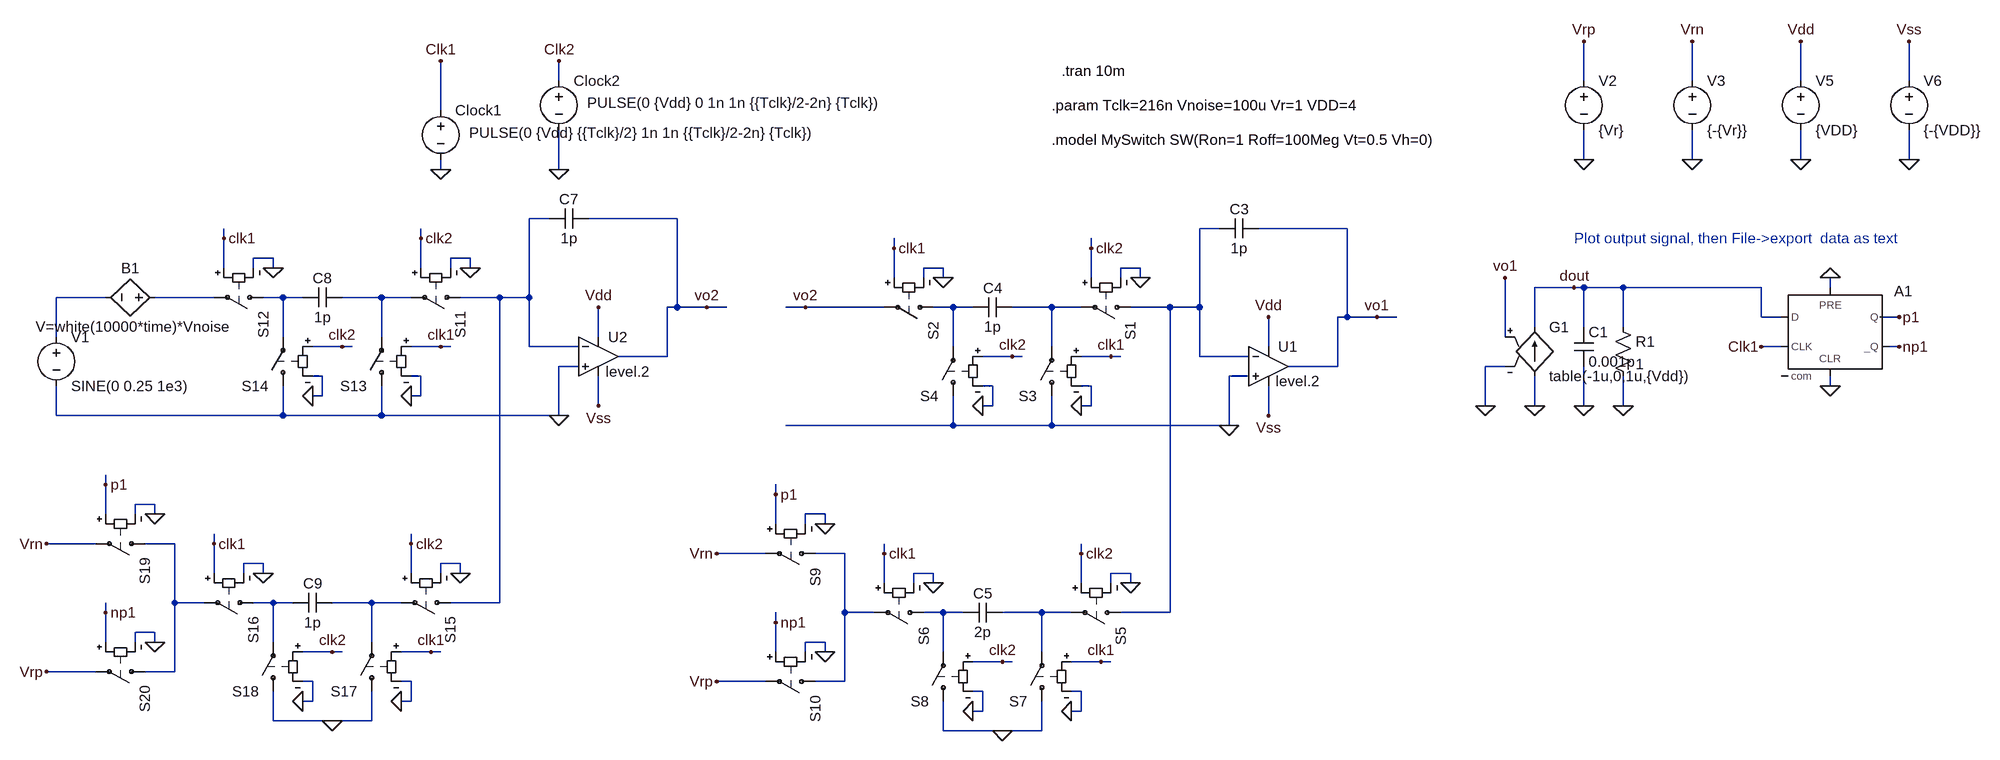
[diagram p0: schematic SC_second_order_v1.asc]
SC_second_order_v1.asc, the LTspice schematic file:
Version 4.1
SHEET 1 948 804
WIRE -1440 -880 -1440 -912
WIRE 224 -880 224 -944
WIRE 400 -880 400 -944
WIRE 576 -880 576 -944
WIRE 752 -880 752 -944
WIRE -1632 -832 -1632 -912
WIRE 224 -752 224 -800
WIRE 400 -752 400 -800
WIRE 576 -752 576 -800
WIRE 752 -752 752 -800
WIRE -1632 -736 -1632 -752
WIRE -1440 -736 -1440 -800
WIRE -1456 -656 -1488 -656
WIRE -1248 -656 -1392 -656
WIRE -368 -640 -400 -640
WIRE -160 -640 -304 -640
WIRE -1984 -624 -1984 -640
WIRE -1664 -624 -1664 -640
WIRE -896 -608 -896 -624
WIRE -576 -608 -576 -624
WIRE -1904 -592 -1936 -592
WIRE -1584 -592 -1616 -592
WIRE -1984 -576 -1984 -624
WIRE -1936 -576 -1936 -592
WIRE -1904 -576 -1904 -592
WIRE -1664 -576 -1664 -624
WIRE -1616 -576 -1616 -592
WIRE -1584 -576 -1584 -592
WIRE -816 -576 -848 -576
WIRE -496 -576 -528 -576
WIRE -896 -560 -896 -608
WIRE -848 -560 -848 -576
WIRE -816 -560 -816 -576
WIRE -576 -560 -576 -608
WIRE -528 -560 -528 -576
WIRE -496 -560 -496 -576
WIRE 208 -544 144 -544
WIRE 224 -544 208 -544
WIRE 288 -544 224 -544
WIRE 512 -544 288 -544
WIRE 624 -544 624 -560
WIRE -2176 -528 -2256 -528
WIRE -2000 -528 -2096 -528
WIRE -1888 -528 -1920 -528
WIRE -1856 -528 -1888 -528
WIRE -1728 -528 -1792 -528
WIRE -1680 -528 -1728 -528
WIRE -1536 -528 -1600 -528
WIRE -1488 -528 -1488 -656
WIRE -1488 -528 -1536 -528
WIRE -1248 -512 -1248 -656
WIRE -1248 -512 -1264 -512
WIRE -1200 -512 -1248 -512
WIRE -1168 -512 -1200 -512
WIRE -1040 -512 -1072 -512
WIRE -912 -512 -1040 -512
WIRE -800 -512 -832 -512
WIRE -768 -512 -800 -512
WIRE -640 -512 -704 -512
WIRE -592 -512 -640 -512
WIRE -448 -512 -512 -512
WIRE -400 -512 -400 -640
WIRE -400 -512 -448 -512
WIRE -160 -496 -160 -640
WIRE -160 -496 -176 -496
WIRE -112 -496 -160 -496
WIRE -80 -496 -112 -496
WIRE 512 -496 512 -544
WIRE 544 -496 512 -496
WIRE 736 -496 704 -496
WIRE 144 -480 144 -544
WIRE 224 -480 224 -544
WIRE 288 -480 288 -544
WIRE -2256 -464 -2256 -528
WIRE -1888 -464 -1888 -528
WIRE -1728 -464 -1728 -528
WIRE -1376 -464 -1376 -512
WIRE 96 -464 96 -560
WIRE -1792 -448 -1840 -448
WIRE -1776 -448 -1792 -448
WIRE -1632 -448 -1680 -448
WIRE -1616 -448 -1632 -448
WIRE -1488 -448 -1488 -528
WIRE -1408 -448 -1488 -448
WIRE -800 -448 -800 -512
WIRE -640 -448 -640 -512
WIRE -288 -448 -288 -496
WIRE 544 -448 512 -448
WIRE 736 -448 720 -448
WIRE -1264 -432 -1264 -512
WIRE -1264 -432 -1344 -432
WIRE -704 -432 -752 -432
WIRE -688 -432 -704 -432
WIRE -544 -432 -592 -432
WIRE -528 -432 -544 -432
WIRE -400 -432 -400 -512
WIRE -320 -432 -400 -432
WIRE -1408 -416 -1440 -416
WIRE -176 -416 -176 -496
WIRE -176 -416 -256 -416
WIRE 96 -416 64 -416
WIRE -1824 -400 -1840 -400
WIRE -1664 -400 -1680 -400
WIRE -320 -400 -352 -400
WIRE -736 -384 -752 -384
WIRE -576 -384 -592 -384
WIRE 624 -384 624 -400
WIRE -1824 -368 -1824 -400
WIRE -1824 -368 -1840 -368
WIRE -1664 -368 -1664 -400
WIRE -1664 -368 -1680 -368
WIRE -1376 -352 -1376 -400
WIRE -736 -352 -736 -384
WIRE -736 -352 -752 -352
WIRE -576 -352 -576 -384
WIRE -576 -352 -592 -352
WIRE 64 -352 64 -416
WIRE 144 -352 144 -400
WIRE 224 -352 224 -416
WIRE 288 -352 288 -400
WIRE -2256 -336 -2256 -384
WIRE -1888 -336 -1888 -384
WIRE -1888 -336 -2256 -336
WIRE -1728 -336 -1728 -384
WIRE -1728 -336 -1888 -336
WIRE -1440 -336 -1440 -416
WIRE -1440 -336 -1728 -336
WIRE -288 -336 -288 -384
WIRE -800 -320 -800 -368
WIRE -800 -320 -1072 -320
WIRE -640 -320 -640 -368
WIRE -640 -320 -800 -320
WIRE -352 -320 -352 -400
WIRE -352 -320 -640 -320
WIRE -2176 -224 -2176 -240
WIRE -1088 -208 -1088 -224
WIRE -2096 -192 -2128 -192
WIRE -2176 -176 -2176 -224
WIRE -2128 -176 -2128 -192
WIRE -2096 -176 -2096 -192
WIRE -1008 -176 -1040 -176
WIRE -1088 -160 -1088 -208
WIRE -1040 -160 -1040 -176
WIRE -1008 -160 -1008 -176
WIRE -2192 -128 -2272 -128
WIRE -2064 -128 -2112 -128
WIRE -2000 -128 -2000 -144
WIRE -1680 -128 -1680 -144
WIRE -1104 -112 -1184 -112
WIRE -976 -112 -1024 -112
WIRE -912 -112 -912 -128
WIRE -592 -112 -592 -128
WIRE -1920 -96 -1952 -96
WIRE -1600 -96 -1632 -96
WIRE -2000 -80 -2000 -128
WIRE -1952 -80 -1952 -96
WIRE -1920 -80 -1920 -96
WIRE -1680 -80 -1680 -128
WIRE -1632 -80 -1632 -96
WIRE -1600 -80 -1600 -96
WIRE -832 -80 -864 -80
WIRE -512 -80 -544 -80
WIRE -912 -64 -912 -112
WIRE -864 -64 -864 -80
WIRE -832 -64 -832 -80
WIRE -592 -64 -592 -112
WIRE -544 -64 -544 -80
WIRE -512 -64 -512 -80
WIRE -2064 -32 -2064 -128
WIRE -2016 -32 -2064 -32
WIRE -1904 -32 -1936 -32
WIRE -1872 -32 -1904 -32
WIRE -1744 -32 -1808 -32
WIRE -1696 -32 -1744 -32
WIRE -1536 -32 -1536 -528
WIRE -1536 -32 -1616 -32
WIRE -2176 -16 -2176 -32
WIRE -976 -16 -976 -112
WIRE -928 -16 -976 -16
WIRE -816 -16 -848 -16
WIRE -784 -16 -816 -16
WIRE -656 -16 -720 -16
WIRE -608 -16 -656 -16
WIRE -448 -16 -448 -512
WIRE -448 -16 -528 -16
WIRE -1088 0 -1088 -16
WIRE -2096 16 -2128 16
WIRE -2176 32 -2176 -16
WIRE -2128 32 -2128 16
WIRE -2096 32 -2096 16
WIRE -1904 32 -1904 -32
WIRE -1744 32 -1744 -32
WIRE -1008 32 -1040 32
WIRE -1808 48 -1856 48
WIRE -1792 48 -1808 48
WIRE -1648 48 -1696 48
WIRE -1632 48 -1648 48
WIRE -1088 48 -1088 0
WIRE -1040 48 -1040 32
WIRE -1008 48 -1008 32
WIRE -816 48 -816 -16
WIRE -656 48 -656 -16
WIRE -720 64 -768 64
WIRE -704 64 -720 64
WIRE -560 64 -608 64
WIRE -544 64 -560 64
WIRE -2192 80 -2272 80
WIRE -2064 80 -2064 -32
WIRE -2064 80 -2112 80
WIRE -1840 96 -1856 96
WIRE -1680 96 -1696 96
WIRE -1104 96 -1184 96
WIRE -976 96 -976 -16
WIRE -976 96 -1024 96
WIRE -752 112 -768 112
WIRE -592 112 -608 112
WIRE -1840 128 -1840 96
WIRE -1840 128 -1856 128
WIRE -1680 128 -1680 96
WIRE -1680 128 -1696 128
WIRE -752 144 -752 112
WIRE -752 144 -768 144
WIRE -592 144 -592 112
WIRE -592 144 -608 144
WIRE -1904 160 -1904 112
WIRE -1808 160 -1904 160
WIRE -1744 160 -1744 112
WIRE -1744 160 -1808 160
WIRE -816 176 -816 128
WIRE -720 176 -816 176
WIRE -656 176 -656 128
WIRE -656 176 -720 176
FLAG 144 -352 0
FLAG 288 -352 0
FLAG 64 -352 0
FLAG 224 -352 0
FLAG 208 -544 dout
FLAG 736 -496 p1
FLAG 736 -448 np1
FLAG 512 -448 Clk1
FLAG 624 -384 0
FLAG 624 -560 0
FLAG -112 -496 vo1
FLAG 96 -560 vo1
FLAG -1632 -736 0
FLAG -1632 -912 Clk1
FLAG -496 -560 0
FLAG -576 -608 clk2
FLAG -816 -560 0
FLAG -896 -608 clk1
FLAG -592 -352 0
FLAG -544 -432 clk1
FLAG -752 -352 0
FLAG -704 -432 clk2
FLAG -1440 -736 0
FLAG -1440 -912 Clk2
FLAG -512 -64 0
FLAG -592 -112 clk2
FLAG -832 -64 0
FLAG -912 -112 clk1
FLAG -608 144 0
FLAG -560 64 clk1
FLAG -768 144 0
FLAG -720 64 clk2
FLAG 224 -752 0
FLAG 400 -752 0
FLAG 224 -944 Vrp
FLAG 400 -944 Vrn
FLAG -1008 -160 0
FLAG -1088 -208 p1
FLAG -1008 48 0
FLAG -1088 0 np1
FLAG -1184 96 Vrp
FLAG -1184 -112 Vrn
FLAG -720 176 0
FLAG -1200 -512 vo2
FLAG -1584 -576 0
FLAG -1664 -624 clk2
FLAG -1904 -576 0
FLAG -1984 -624 clk1
FLAG -1680 -368 0
FLAG -1632 -448 clk1
FLAG -1840 -368 0
FLAG -1792 -448 clk2
FLAG -1600 -80 0
FLAG -1680 -128 clk2
FLAG -1920 -80 0
FLAG -2000 -128 clk1
FLAG -1696 128 0
FLAG -1648 48 clk1
FLAG -1856 128 0
FLAG -1808 48 clk2
FLAG -2096 -176 0
FLAG -2176 -224 p1
FLAG -2096 32 0
FLAG -2176 -16 np1
FLAG -2272 80 Vrp
FLAG -2272 -128 Vrn
FLAG -1808 160 0
FLAG -1040 -512 vo2
FLAG -1440 -336 0
FLAG -1376 -512 Vdd
FLAG -1376 -352 Vss
FLAG -352 -320 0
FLAG -288 -496 Vdd
FLAG -288 -336 Vss
FLAG 576 -752 0
FLAG 752 -752 0
FLAG 576 -944 Vdd
FLAG 752 -944 Vss
SYMBOL g 144 -496 R0
SYMATTR InstName G1
SYMATTR Value table(-1u,0,1u,{Vdd})
SYMBOL res 272 -496 R0
SYMATTR InstName R1
SYMATTR Value 1
SYMBOL cap 208 -480 R0
SYMATTR InstName C1
SYMATTR Value 0.001p
SYMBOL Digital\\dflop 624 -544 R0
SYMATTR SpiceLine Trise = 0.1n Tfall =0.1n Td =0.1n  Vhigh = {Vdd}  Vlow = 0  Ref = {{Vdd}/2}
SYMATTR InstName A1
SYMBOL sw -496 -512 R90
SYMATTR InstName S1
SYMATTR Value ""
SYMATTR SpiceModel MySwitch
SYMBOL cap -304 -656 R90
WINDOW 0 0 32 VBottom 2
WINDOW 3 32 32 VTop 2
SYMATTR InstName C3
SYMATTR Value 1p
SYMBOL cap -704 -528 R90
WINDOW 0 0 32 VBottom 2
WINDOW 3 32 32 VTop 2
SYMATTR InstName C4
SYMATTR Value 1p
SYMBOL voltage -2256 -480 R0
WINDOW 123 0 0 Left 0
WINDOW 39 0 0 Left 0
SYMATTR InstName V1
SYMATTR Value SINE(0 0.25 1e3)
SYMBOL voltage -1632 -848 R0
WINDOW 123 0 0 Left 2
WINDOW 39 0 0 Left 2
WINDOW 3 46 52 Left 2
SYMATTR Value PULSE(0 {Vdd} {{Tclk}/2} 1n 1n {{Tclk}/2-2n} {Tclk})
SYMATTR InstName Clock1
SYMBOL sw -816 -512 R90
SYMATTR InstName S2
SYMATTR Value ""
SYMATTR SpiceModel MySwitch
SYMBOL sw -640 -352 R180
SYMATTR InstName S3
SYMATTR Value ""
SYMATTR SpiceModel MySwitch
SYMBOL sw -800 -352 R180
SYMATTR InstName S4
SYMATTR Value ""
SYMATTR SpiceModel MySwitch
SYMBOL sw -512 -16 R90
SYMATTR InstName S5
SYMATTR Value ""
SYMATTR SpiceModel MySwitch
SYMBOL cap -720 -32 R90
WINDOW 0 0 32 VBottom 2
WINDOW 3 32 32 VTop 2
SYMATTR InstName C5
SYMATTR Value 2p
SYMBOL sw -832 -16 R90
SYMATTR InstName S6
SYMATTR Value ""
SYMATTR SpiceModel MySwitch
SYMBOL sw -656 144 R180
SYMATTR InstName S7
SYMATTR Value ""
SYMATTR SpiceModel MySwitch
SYMBOL sw -816 144 R180
SYMATTR InstName S8
SYMATTR Value ""
SYMATTR SpiceModel MySwitch
SYMBOL voltage 224 -896 R0
WINDOW 123 0 0 Left 0
WINDOW 39 0 0 Left 0
SYMATTR InstName V2
SYMATTR Value {Vr}
SYMBOL voltage 400 -896 R0
WINDOW 123 0 0 Left 0
WINDOW 39 0 0 Left 0
SYMATTR InstName V3
SYMATTR Value {-{Vr}}
SYMBOL sw -1008 -112 R90
SYMATTR InstName S9
SYMATTR Value ""
SYMATTR SpiceModel MySwitch
SYMBOL sw -1008 96 R90
SYMATTR InstName S10
SYMATTR Value ""
SYMATTR SpiceModel MySwitch
SYMBOL voltage -1440 -896 R0
WINDOW 123 0 0 Left 2
WINDOW 39 0 0 Left 2
WINDOW 3 46 52 Left 2
SYMATTR Value PULSE(0 {Vdd} 0 1n 1n {{Tclk}/2-2n} {Tclk})
SYMATTR InstName Clock2
SYMBOL sw -1584 -528 R90
SYMATTR InstName S11
SYMATTR Value ""
SYMATTR SpiceModel MySwitch
SYMBOL cap -1392 -672 R90
WINDOW 0 0 32 VBottom 2
WINDOW 3 32 32 VTop 2
SYMATTR InstName C7
SYMATTR Value 1p
SYMBOL cap -1792 -544 R90
WINDOW 0 0 32 VBottom 2
WINDOW 3 32 32 VTop 2
SYMATTR InstName C8
SYMATTR Value 1p
SYMBOL sw -1904 -528 R90
SYMATTR InstName S12
SYMATTR Value ""
SYMATTR SpiceModel MySwitch
SYMBOL sw -1728 -368 R180
SYMATTR InstName S13
SYMATTR Value ""
SYMATTR SpiceModel MySwitch
SYMBOL sw -1888 -368 R180
SYMATTR InstName S14
SYMATTR Value ""
SYMATTR SpiceModel MySwitch
SYMBOL sw -1600 -32 R90
SYMATTR InstName S15
SYMATTR Value ""
SYMATTR SpiceModel MySwitch
SYMBOL cap -1808 -48 R90
WINDOW 0 0 32 VBottom 2
WINDOW 3 32 32 VTop 2
SYMATTR InstName C9
SYMATTR Value 1p
SYMBOL sw -1920 -32 R90
SYMATTR InstName S16
SYMATTR Value ""
SYMATTR SpiceModel MySwitch
SYMBOL sw -1744 128 R180
SYMATTR InstName S17
SYMATTR Value ""
SYMATTR SpiceModel MySwitch
SYMBOL sw -1904 128 R180
SYMATTR InstName S18
SYMATTR Value ""
SYMATTR SpiceModel MySwitch
SYMBOL sw -2096 -128 R90
SYMATTR InstName S19
SYMATTR Value ""
SYMATTR SpiceModel MySwitch
SYMBOL sw -2096 80 R90
SYMATTR InstName S20
SYMATTR Value ""
SYMATTR SpiceModel MySwitch
SYMBOL voltage 576 -896 R0
WINDOW 123 0 0 Left 0
WINDOW 39 0 0 Left 0
SYMATTR InstName V5
SYMATTR Value {VDD}
SYMBOL voltage 752 -896 R0
WINDOW 123 0 0 Left 0
WINDOW 39 0 0 Left 0
SYMATTR InstName V6
SYMATTR Value {-{VDD}}
SYMBOL opamps\\UniversalOpamp2 -1376 -432 R0
WINDOW 38 12 24 Left 2
SYMATTR InstName U2
SYMATTR Value2 Avol=1Meg GBW=100Meg Slew=100Meg
SYMBOL opamps\\UniversalOpamp2 -288 -416 R0
WINDOW 38 12 24 Left 2
SYMATTR InstName U1
SYMATTR Value2 Avol=1Meg GBW=100Meg Slew=100Meg
SYMBOL bv -2080 -528 R90
WINDOW 0 -32 56 VBottom 2
WINDOW 3 32 56 VTop 2
SYMATTR InstName B1
SYMATTR Value V=white(10000*time)*Vnoise
TEXT -640 -784 Left 2 !.model MySwitch SW(Ron=1 Roff=100Meg Vt=0.5 Vh=0)
TEXT -624 -896 Left 2 !.tran 10m
TEXT -640 -840 Left 2 !.param Tclk=216n Vnoise=100u Vr=1 VDD=4
TEXT 208 -624 Left 2 ;Plot output signal, then File->export  data as text

The netlist it stands for:
* SC_second_order_v1.asc
G1 0 dout vo1 0 table(-1u,0,1u,{Vdd})
R1 dout 0 1
C1 dout 0 0.001p
A1 dout 0 Clk1 0 0 np1 p1 0 DFLOP Trise = 0.1n Tfall =0.1n Td =0.1n  Vhigh = {Vdd}  Vlow = 0  Ref = {{Vdd}/2}
S1 N002 N008 clk2 0 MySwitch
C3 vo1 N002 1p
C4 N008 N007 1p
V1 N003 0 SINE(0 0.25 1e3)
V§Clock1 Clk1 0 PULSE(0 {Vdd} {{Tclk}/2} 1n 1n {{Tclk}/2-2n} {Tclk})
S2 N007 vo2 Clk1 0 MySwitch
S3 0 N008 Clk1 0 MySwitch
S4 0 N007 clk2 0 MySwitch
S5 N002 N014 clk2 0 MySwitch
C5 N014 N013 2p
S6 N013 N010 Clk1 0 MySwitch
S7 0 N014 Clk1 0 MySwitch
S8 0 N013 clk2 0 MySwitch
V2 Vrp 0 {Vr}
V3 Vrn 0 {-{Vr}}
S9 N010 Vrn p1 0 MySwitch
S10 N010 Vrp np1 0 MySwitch
V§Clock2 clk2 0 PULSE(0 {Vdd} 0 1n 1n {{Tclk}/2-2n} {Tclk})
S11 N001 N006 clk2 0 MySwitch
C7 vo2 N001 1p
C8 N006 N005 1p
S12 N005 N004 Clk1 0 MySwitch
S13 0 N006 Clk1 0 MySwitch
S14 0 N005 clk2 0 MySwitch
S15 N001 N012 clk2 0 MySwitch
C9 N012 N011 1p
S16 N011 N009 Clk1 0 MySwitch
S17 0 N012 Clk1 0 MySwitch
S18 0 N011 clk2 0 MySwitch
S19 N009 Vrn p1 0 MySwitch
S20 N009 Vrp np1 0 MySwitch
V5 Vdd 0 {VDD}
V6 Vss 0 {-{VDD}}
X§U2 0 N001 Vdd Vss vo2 level.2 Avol=1Meg GBW=100Meg Slew=100Meg ilimit=25m rail=0 Vos=0 phimargin=45 en=0 enk=0 in=0 ink=0 Rin=500Meg  ; pins IN+ IN- V+ V- OUT
X§U1 0 N002 Vdd Vss vo1 level.2 Avol=1Meg GBW=100Meg Slew=100Meg ilimit=25m rail=0 Vos=0 phimargin=45 en=0 enk=0 in=0 ink=0 Rin=500Meg  ; pins IN+ IN- V+ V- OUT
B1 N004 N003 V=white(10000*time)*Vnoise
.model MySwitch SW(Ron=1 Roff=100Meg Vt=0.5 Vh=0)
.tran 10m
.param Tclk=216n Vnoise=100u Vr=1 VDD=4
* Plot output signal, then File->export  data as text
.lib UniversalOpamps2.sub
.backanno
.end